# Altium schematic sheet 电容测量.SchDoc
size A4
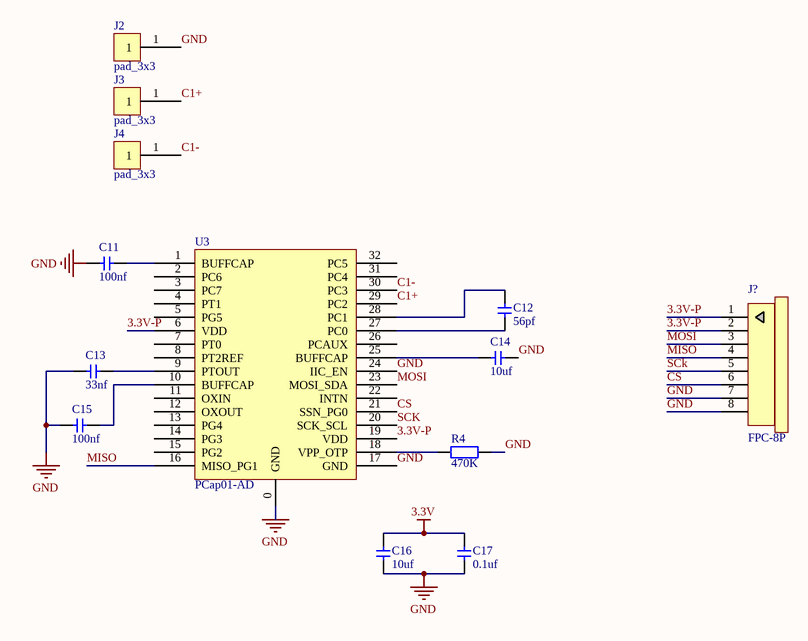
[diagram p0: 电容测量.SchDoc]

## Parts
C11  value 100nf  [0603-2]  (hidden comment: Cap)
C12  value 56pf  [0603-2]  (hidden comment: Cap)
C13  value 33nf  [0603-2]  (hidden comment: Cap)
C14  value 10uf  [0603-2]  (hidden comment: Cap)
C15  value 100nf  [0603-2]  (hidden comment: Cap)
C16  value 10uf  [0603-2]  (hidden comment: Cap)
C17  value 0.1uf  [0603-2]  (hidden comment: Cap)
J2  pad_3x3  [pad_3x3]
J3  pad_3x3  [pad_3x3]
J4  pad_3x3  [pad_3x3]
J?  FPC-8P  [FPC0.5-8P-C]
R4  value 470K  [0603-2]  (hidden comment: Res1)
U3  PCap01-AD  [QFN-32_5x5x05]

## Nets
3.3V: C16.2 C17.2
GND: C11.2 C13.2 C14.1 C15.1 C16.1 C17.1 J2.1 J?.7 J?.8 R4.2 U3.0(GND) U3.17(GND) U3.24(IIC_EN)
3.3V-P: J?.1 J?.2 U3.6(VDD) U3.19(VDD)
C1+: J3.1 U3.29(PC2)
C1-: J4.1 U3.30(PC3)
CS: J?.6 U3.21(SSN_PG0)
MISO: J?.4 U3.16(MISO_PG1)
MOSI: J?.3 U3.23(MOSI_SDA)
SCK: J?.5 U3.20(SCK_SCL)
NetC11_1: C11.1 U3.1(BUFFCAP)
NetC12_1: C12.1 U3.27(PC0)
NetC12_2: C12.2 U3.28(PC1)
NetC13_1: C13.1 U3.9(PTOUT)
NetC14_2: C14.2 U3.25(BUFFCAP)
NetC15_2: C15.2 U3.10(BUFFCAP)
NetR4_1: R4.1 U3.18(VPP_OTP)

Not connected (* = marked no-connect by the designer): U3 2(PC6) 3(PC7) 4(PT1) 5(PG5) 7(PT0) 8(PT2REF) 11(OXIN) 12(OXOUT) 13(PG4) 14(PG3) 15(PG2) 22(INTN) 26(PCAUX) 31(PC4) 32(PC5)

## Library data of the parts
C11-C17 = Cap: 无极性电容; Published: 8-Jun-2000; LatestRevisionDate: 17-Jul-2002; LatestRevisionNote: Re-released for DXP Platform.; PackageReference: RAD-0.3; Publisher: Altium Limited
J2-J4 = pad_3x3: 焊盘接口
J? = FPC-8P: FPC排线连接器
R4 = Res1: 贴片电阻; Published: 8-Jun-2000; LatestRevisionDate: 17-Jul-2002; LatestRevisionNote: Re-released for DXP Platform.; PackageReference: AXIAL-0.4; Publisher: Altium Limited
U3 = Pcap01AD: 电容测量芯片